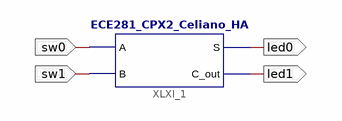
[diagram p0: schematic sheet 1]
// Xilinx ISE schematic ECE281_CPX2_Celiano_Top.sch (spartan3e) as structural Verilog: 1 symbols, 4 ports
module ECE281_CPX2_Celiano_Top (
  input  sw0,
  input  sw1,
  output led0,
  output led1
);

  ECE281_CPX2_Celiano_HA XLXI_1 (.A(sw0), .B(sw1), .S(led0), .C_out(led1));
endmodule
